# Altium schematic sheet Peripherals_HUMA-mini.SchDoc
size A4
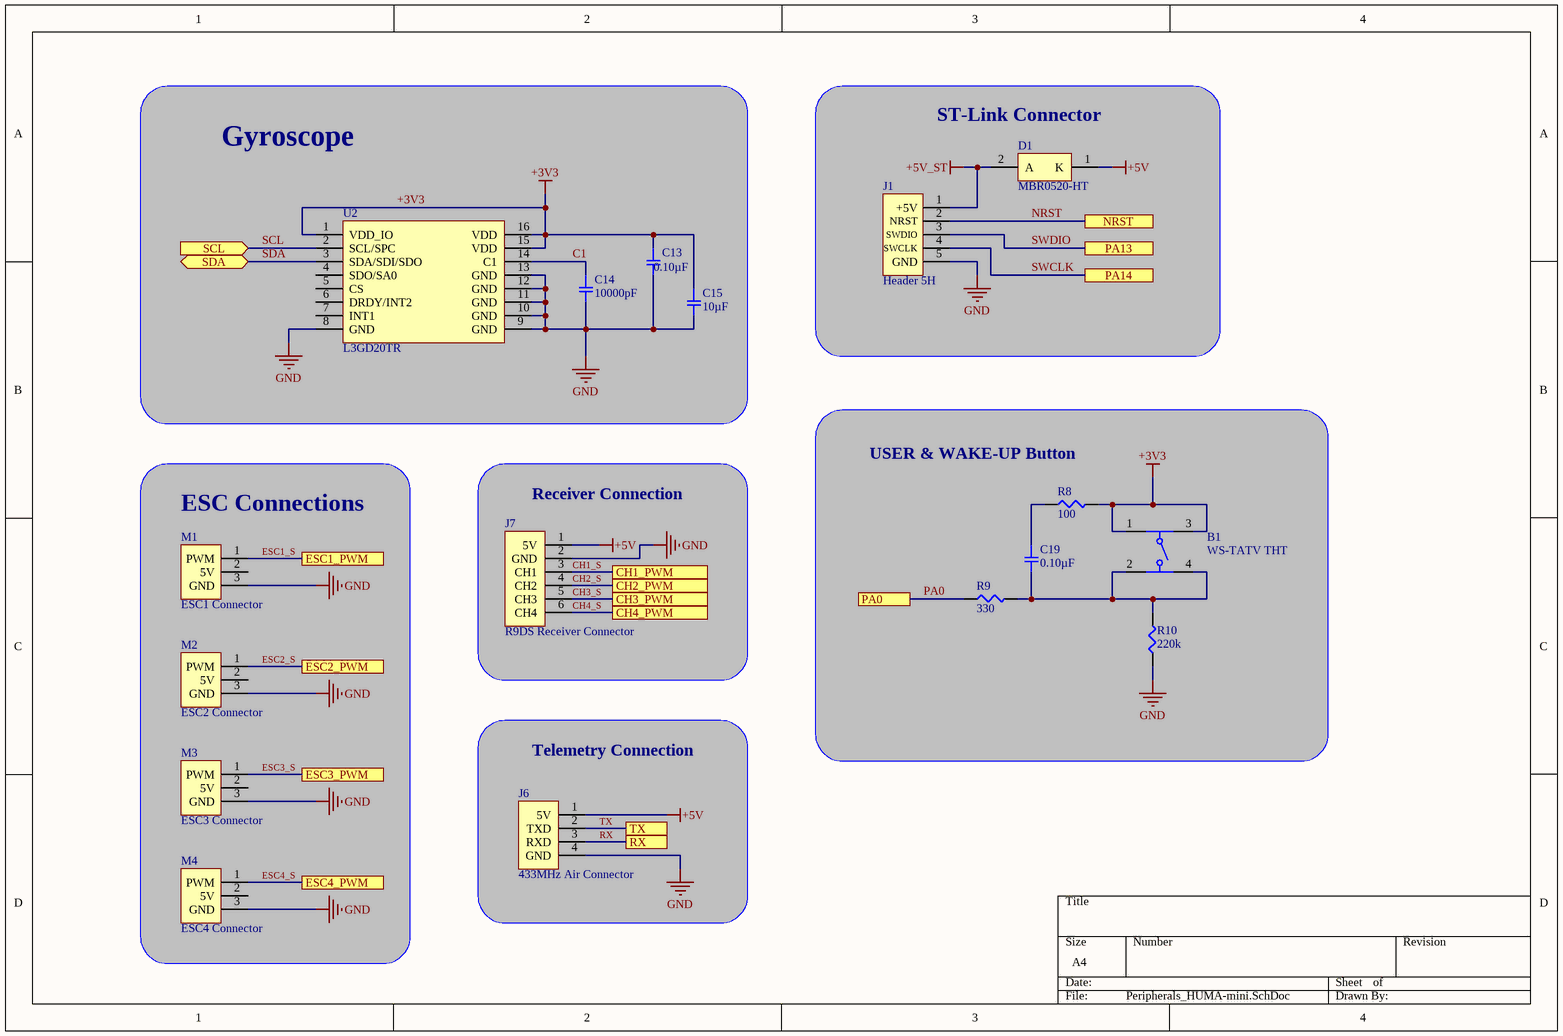
[diagram p0: Peripherals_HUMA-mini.SchDoc]

## Parts
B1  WS-TATV THT  [4301x60507x6]
C13  0.10µF  [SMD-0805C]
C14  10000pF  [SMD-0805C]
C15  10µF  [SMD-0805C]
C19  0.10µF  [SMD-0805C]
D1  MBR0520-HT  [ONSC-SOD-123-2-425-04_V]
J1  Header 5H  [HDR1X5H]
J6  433MHz Air Connector  [HDR1X4H]
J7  R9DS Receiver Connector  [HDR1X6H]
M1  ESC1 Connector  [HDR1X3H]
M2  ESC2 Connector  [HDR1X3H]
M3  ESC3 Connector  [HDR1X3H]
M4  ESC4 Connector  [HDR1X3H]
R8  100  [SMD-0805-RES]
R9  330  [SMD-0805-RES]
R10  220k  [SMD-0805-RES]
U2  L3GD20TR  [LGA16C65P6X6_400X400X100]  (value not drawn)

## Blocks framed on the sheet
Gyroscope: C13-C15 U2
ST-Link Connector: D1 J1
USER & WAKE-UP Button: B1 C19 R8-R10
ESC Connections: M1-M4
Receiver Connection: J7
Telemetry Connection: J6

## Ports
CH1_PWM, CH2_PWM, CH3_PWM, CH4_PWM, ESC1_PWM, ESC2_PWM, ESC3_PWM, ESC4_PWM, NRST, PA0, PA13, PA14, RX, SCL (in), SDA (bidir), TX

## Nets
+3V3: B1.1 B1.3 C13.1 C15.1 R8.2 U2.1(VDD_IO) U2.15(VDD) U2.16(VDD)
+5V: D1.1(K) J6.1(5V) J7.1(5V)
+5V_ST: D1.2(A) J1.1(+5V)
GND: C13.2 C14.2 C15.2 J1.5(GND) J6.4(GND) J7.2(GND) M1.3(GND) M2.3(GND) M3.3(GND) M4.3(GND) R10.1 U2.8(GND) U2.9(GND) U2.10(GND) U2.11(GND) U2.12(GND) U2.13(GND)
C1: C14.1 U2.14(C1)
CH1_S: J7.3(CH1) ; port CH1_PWM
CH2_S: J7.4(CH2) ; port CH2_PWM
CH3_S: J7.5(CH3) ; port CH3_PWM
CH4_S: J7.6(CH4) ; port CH4_PWM
ESC1_S: M1.1(PWM) ; port ESC1_PWM
ESC2_S: M2.1(PWM) ; port ESC2_PWM
ESC3_S: M3.1(PWM) ; port ESC3_PWM
ESC4_S: M4.1(PWM) ; port ESC4_PWM
NRST: J1.2(NRST) ; port NRST
PA0: R9.1 ; port PA0
RX: J6.3(RXD) ; port RX
SCL: U2.2(SCL/SPC) ; port SCL
SDA: U2.3(SDA/SDI/SDO) ; port SDA
SWCLK: J1.4(SWCLK) ; port PA14
SWDIO: J1.3(SWDIO) ; port PA13
TX: J6.2(TXD) ; port TX
NetB1_2: B1.2 B1.4 C19.2 R9.2 R10.2
NetC19_1: C19.1 R8.1

Not connected (* = marked no-connect by the designer): M1 2(5V); M2 2(5V); M3 2(5V); M4 2(5V); U2 4(SDO/SA0) 5(CS) 6(DRDY/INT2) 7(INT1)

## Library data of the parts
B1 = 430156050726: WS-TATV THT Tact Switch 6x6mm, height 5mm, 260gf; Rated Voltage: 12VDC; Rated Current: 50mA; Washable: No; ComponentLink1Description: Manufacturer; ComponentLink1URL: http://www.we-online.de; ComponentLink2Description: Datasheet; ComponentLink2URL: https://katalog.we-online.com/em/datasheet/430156050726.pdf; Operating Temperature: -40 to +85degC; Part Number: 430156050726; Published Date: September 2019; Contact Material: Stainless Steel; Height: 5mm; Mounting Technology: THT; Contact Plating: Silver; Operation Force: 260gf; Packaging: Bulk; Terminal Material: Copper Alloy; Publisher: Wurth Elektronik; Terminal Plating: Silver
C13 = GRM219R71E104KA01D: CAP CER 0.1UF 25V X7R 0805; Manufacturer: Murata Electronics North America; Factory Stock: 0; Unit Price (USD): 0.12; Minimum Quantity: 1; Tolerance: ±10%; Datasheets: http://www.murata.com/~/media/webrenewal/support/library/catalog/products/capacitor/mlcc/c02e.pdf; Image: //media.digikey.com/Renders/Murata%20Renders/0805%20(2012%20Metric)%20.85mm.jpg; Digi-Key Part Number: 490-12754-1-ND; Part Number: GRM219R71E104KA01D; Quantity Available: 8594; @ qty: 0; Packaging: Cut Tape (CT); Series: GRM; Part Status: Active; Value: 0.10µF; Voltage: 25V; Temperature Coefficient: X7R; Operating Temperature: -55°C ~ 125°C; Features: -; Ratings: -; Applications: General Purpose; Mounting Type: Surface Mount, MLCC; Package / Case: 0805 (2012 Metric); Size / Dimension: 0.079" L x 0.049" W (2.00mm x 1.25mm); Height - Seated (Max): -; Thickness (Max): 0.037" (0.95mm); Lead Spacing: -; Lead Style: -
C14 = LLA215R71E103MA14L: CAP CER 10000PF 25V X7R 0805; Manufacturer: Murata Electronics North America; Factory Stock: 0; Unit Price (USD): 0.33; Minimum Quantity: 1; Tolerance: ±20%; Datasheets: http://www.murata.com/~/media/webrenewal/support/library/catalog/products/capacitor/mlcc/c02e.pdf; Image: //media.digikey.com/Renders/Murata%20Renders/0805-LLA.jpg; Digi-Key Part Number: 490-4424-1-ND; Part Number: LLA215R71E103MA14L; Quantity Available: 28252; @ qty: 0; Packaging: Cut Tape (CT); Series: LLA; Part Status: Active; Value: 10000pF; Voltage: 25V; Temperature Coefficient: X7R; Operating Temperature: -55°C ~ 125°C; Features: Low ESL (Multi-Terminal); Ratings: -; Applications: Bypass, Decoupling; Mounting Type: Surface Mount, MLCC; Package / Case: 0805 (2012 Metric); Size / Dimension: 0.079" L x 0.049" W (2.00mm x 1.25mm); Height - Seated (Max): -; Thickness (Max): 0.022" (0.55mm); Lead Spacing: -; Lead Style: -
C15 = GRM21BC81C106KA73L: CAP CER 10UF 16V X6S 0805; Manufacturer: Murata Electronics North America; Factory Stock: 0; Unit Price (USD): 0.2; Minimum Quantity: 1; Tolerance: ±10%; Datasheets: http://www.murata.com/~/media/webrenewal/support/library/catalog/products/capacitor/mlcc/c02e.pdf; Image: //media.digikey.com/Renders/Murata%20Renders/0805%20(2012%20Metric)%20.85mm.jpg; Digi-Key Part Number: 490-5519-1-ND; Part Number: GRM21BC81C106KA73L; Quantity Available: 118069; @ qty: 0; Packaging: Cut Tape (CT); Series: GRM; Part Status: Active; Value: 10µF; Voltage: 16V; Temperature Coefficient: X6S; Operating Temperature: -55°C ~ 105°C; Features: -; Ratings: -; Applications: General Purpose; Mounting Type: Surface Mount, MLCC; Package / Case: 0805 (2012 Metric); Size / Dimension: 0.079" L x 0.049" W (2.00mm x 1.25mm); Height - Seated (Max): -; Thickness (Max): 0.053" (1.35mm); Lead Spacing: -; Lead Style: -
C19 = GRM21B7U1A104JA01L: CAP CER 0.1UF 10V U2J 0805; Manufacturer: Murata Electronics North America; Factory Stock: 0; Unit Price (USD): 0.4; Minimum Quantity: 1; Tolerance: ±5%; Datasheets: http://www.murata.com/~/media/webrenewal/support/library/catalog/products/capacitor/mlcc/c02e.pdf; Image: //media.digikey.com/Renders/Murata%20Renders/0805%20(2012%20Metric)%20.85mm.jpg; Digi-Key Part Number: 490-11592-1-ND; Part Number: GRM21B7U1A104JA01L; Quantity Available: 3390; @ qty: 0; Packaging: Cut Tape (CT); Series: GRM; Part Status: Active; Value: 0.10µF; Voltage: 10V; Temperature Coefficient: U2J; Operating Temperature: -55°C ~ 125°C; Features: -; Ratings: -; Applications: General Purpose; Mounting Type: Surface Mount, MLCC; Package / Case: 0805 (2012 Metric); Size / Dimension: 0.079" L x 0.049" W (2.00mm x 1.25mm); Height - Seated (Max): -; Thickness (Max): 0.053" (1.35mm); Lead Spacing: -; Lead Style: -
D1 = MBR0520LT1: 20V 0.5A Schottky Power Rectifier, 2-Pin SOD-123, Tape and Reel; Manufacturer: On Semiconductor; Configuration: Single; IFSM Max (A): 5.5; DatasheetVersion: Rev. 6; PackageVersion: Rev. G, 10/2009; PackageReference: SOD-123-2-425-04; PackageDescription: 2-Pin SOD, Body 1.6 x 2.69 mm; Supplier 1: Digi-Key; Supplier Part Number 1: MBR0520LT1OSCT-ND; Packing: Tape and Reel; RoHS: FALSE; Mounting Technology: Surface Mount; PartNumber: MBR0520LT1; ComponentLink1Description: Manufacturer URL; ComponentLink1URL: http://www.onsemi.com/; ComponentLink2Description: Datasheet; ComponentLink2URL: http://www.onsemi.cn/pub_link/Collateral/MBR0520LT1-D.PDF; ComponentLink3Description: Package Specification; ComponentLink3URL: http://www.onsemi.com/pub_link/Collateral/425-04.PDF
J1 = Header 5H: Header, 5-Pin, Right Angle; LatestRevisionDate: 17-Jul-2002; LatestRevisionNote: Re-released for DXP Platform.; Publisher: Altium Limited
J6 = Header 4H: Header, 4-Pin, Right Angle; LatestRevisionDate: 17-Jul-2002; LatestRevisionNote: Re-released for DXP Platform.; Publisher: Altium Limited
J7 = Header 6H: Header, 6-Pin, Right Angle; LatestRevisionDate: 17-Jul-2002; LatestRevisionNote: Re-released for DXP Platform.; Publisher: Altium Limited
M1-M4 = Header 3H: Header, 3-Pin, Right Angle; LatestRevisionDate: 17-Jul-2002; LatestRevisionNote: Re-released for DXP Platform.; Publisher: Altium Limited
R8 = ERJ-P06J101V: RES SMD 100 OHM 5% 1/2W 0805; Manufacturer: Panasonic Electronic Components; Factory Stock: 0; Unit Price (USD): 0.01839; @ qty: 1500; Minimum Quantity: 1; Power (Watts): 0.5W, 1/2W; Temperature Coefficient: ±200ppm/°C; Part Number: ERJ-P06J101V; Datasheets: https://industrial.panasonic.com/cdbs/www-data/pdf/RDA0000/AOA0000C243.pdf; Image: //media.digikey.com/Renders/Panasonic%20Renders/ERJ-0805%20Pkg.jpg; Digi-Key Part Number: P100ADCT-ND; Quantity Available: 127985; Packaging: Cut Tape (CT); Series: ERJ; Part Status: Active; Value: 100; Tolerance: ±5%; Composition: Thick Film; Features: Automotive AEC-Q200, Pulse Withstanding; Operating Temperature: -55°C ~ 155°C; Package / Case: 0805 (2012 Metric); Supplier Device Package: 0805; Size / Dimension: 0.079" L x 0.049" W (2.00mm x 1.25mm); Height - Seated (Max): 0.028" (0.70mm); Number of Terminations: 2; Failure Rate: -
R9 = ERJ-P6WJ331V: RES SMD 330 OHM 5% 1/2W 0805; Manufacturer: Panasonic Electronic Components; Factory Stock: 0; Unit Price (USD): 0.08237; @ qty: 1500; Minimum Quantity: 1; Power (Watts): 0.5W, 1/2W; Temperature Coefficient: ±200ppm/°C; Part Number: ERJ-P6WJ331V; Datasheets: https://industrial.panasonic.com/cdbs/www-data/pdf/RDA0000/AOA0000C243.pdf; Image: //media.digikey.com/Renders/Panasonic%20Renders/ERJ-0805%20Pkg.jpg; Digi-Key Part Number: P16948CT-ND; Quantity Available: 4857; Packaging: Cut Tape (CT); Series: ERJ; Part Status: Active; Value: 330; Tolerance: ±5%; Composition: Thick Film; Features: Automotive AEC-Q200, Pulse Withstanding; Operating Temperature: -55°C ~ 155°C; Package / Case: 0805 (2012 Metric); Supplier Device Package: 0805; Size / Dimension: 0.079" L x 0.049" W (2.00mm x 1.25mm); Height - Seated (Max): 0.030" (0.75mm); Number of Terminations: 2; Failure Rate: -
R10 = ERJ-P06J224V: RES SMD 220K OHM 5% 1/2W 0805; Manufacturer: Panasonic Electronic Components; Factory Stock: 0; Unit Price (USD): 0.01839; @ qty: 1500; Minimum Quantity: 1; Power (Watts): 0.5W, 1/2W; Temperature Coefficient: ±200ppm/°C; Part Number: ERJ-P06J224V; Datasheets: https://industrial.panasonic.com/cdbs/www-data/pdf/RDA0000/AOA0000C243.pdf; Image: //media.digikey.com/Renders/Panasonic%20Renders/ERJ-0805%20Pkg.jpg; Digi-Key Part Number: P220KADCT-ND; Quantity Available: 20074; Packaging: Cut Tape (CT); Series: ERJ; Part Status: Active; Value: 220k; Tolerance: ±5%; Composition: Thick Film; Features: Automotive AEC-Q200, Pulse Withstanding; Operating Temperature: -55°C ~ 155°C; Package / Case: 0805 (2012 Metric); Supplier Device Package: 0805; Size / Dimension: 0.079" L x 0.049" W (2.00mm x 1.25mm); Height - Seated (Max): 0.028" (0.70mm); Number of Terminations: 2; Failure Rate: -
U2 = L3GD20TR: Gyroscope X (Pitch), Y (Roll), Z (Yaw) ±250, 500, 2000 47.5Hz ~ 380Hz I²C, SPI 16-LGA (4x4); PartName: L3GD20TR